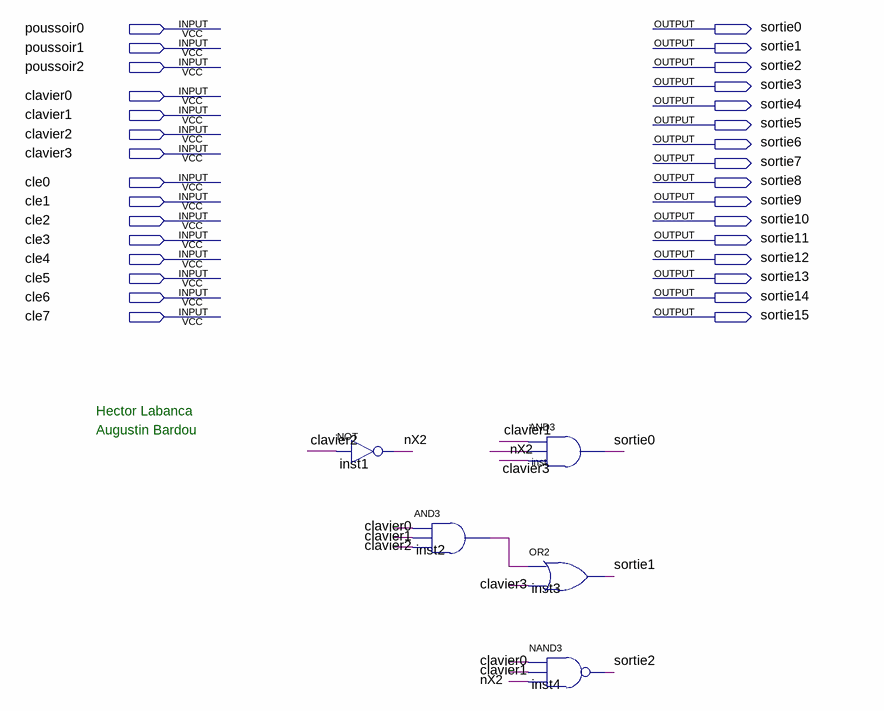
[diagram p0: schematic sheet]
// Quartus schematic fpga1.bdf as structural Verilog: 5 symbols, 31 pins
module fpga1 (
  input  poussoir0,
  input  poussoir1,
  input  poussoir2,
  input  clavier0,
  input  clavier1,
  input  clavier2,
  input  clavier3,
  input  cle0,
  input  cle1,
  input  cle2,
  input  cle3,
  input  cle4,
  input  cle5,
  input  cle6,
  input  cle7,
  output sortie0,
  output sortie1,
  output sortie2,
  output sortie3,
  output sortie4,
  output sortie5,
  output sortie6,
  output sortie7,
  output sortie8,
  output sortie9,
  output sortie10,
  output sortie11,
  output sortie12,
  output sortie13,
  output sortie14,
  output sortie15
);

  wire inst2_out, nX2;

  not inst1 (nX2, clavier2);
  and inst2 (inst2_out, clavier0, clavier1, clavier2);
  and inst (sortie0, clavier1, nX2, clavier3);
  or inst3 (sortie1, inst2_out, clavier3);
  nand inst4 (sortie2, clavier0, clavier1, nX2);

  // Notes on the sheet:
  //   Hector Labanca
  //   Augustin Bardou
endmodule
